# EAGLE schematic Cing bot (EAGLE 7.2.0)
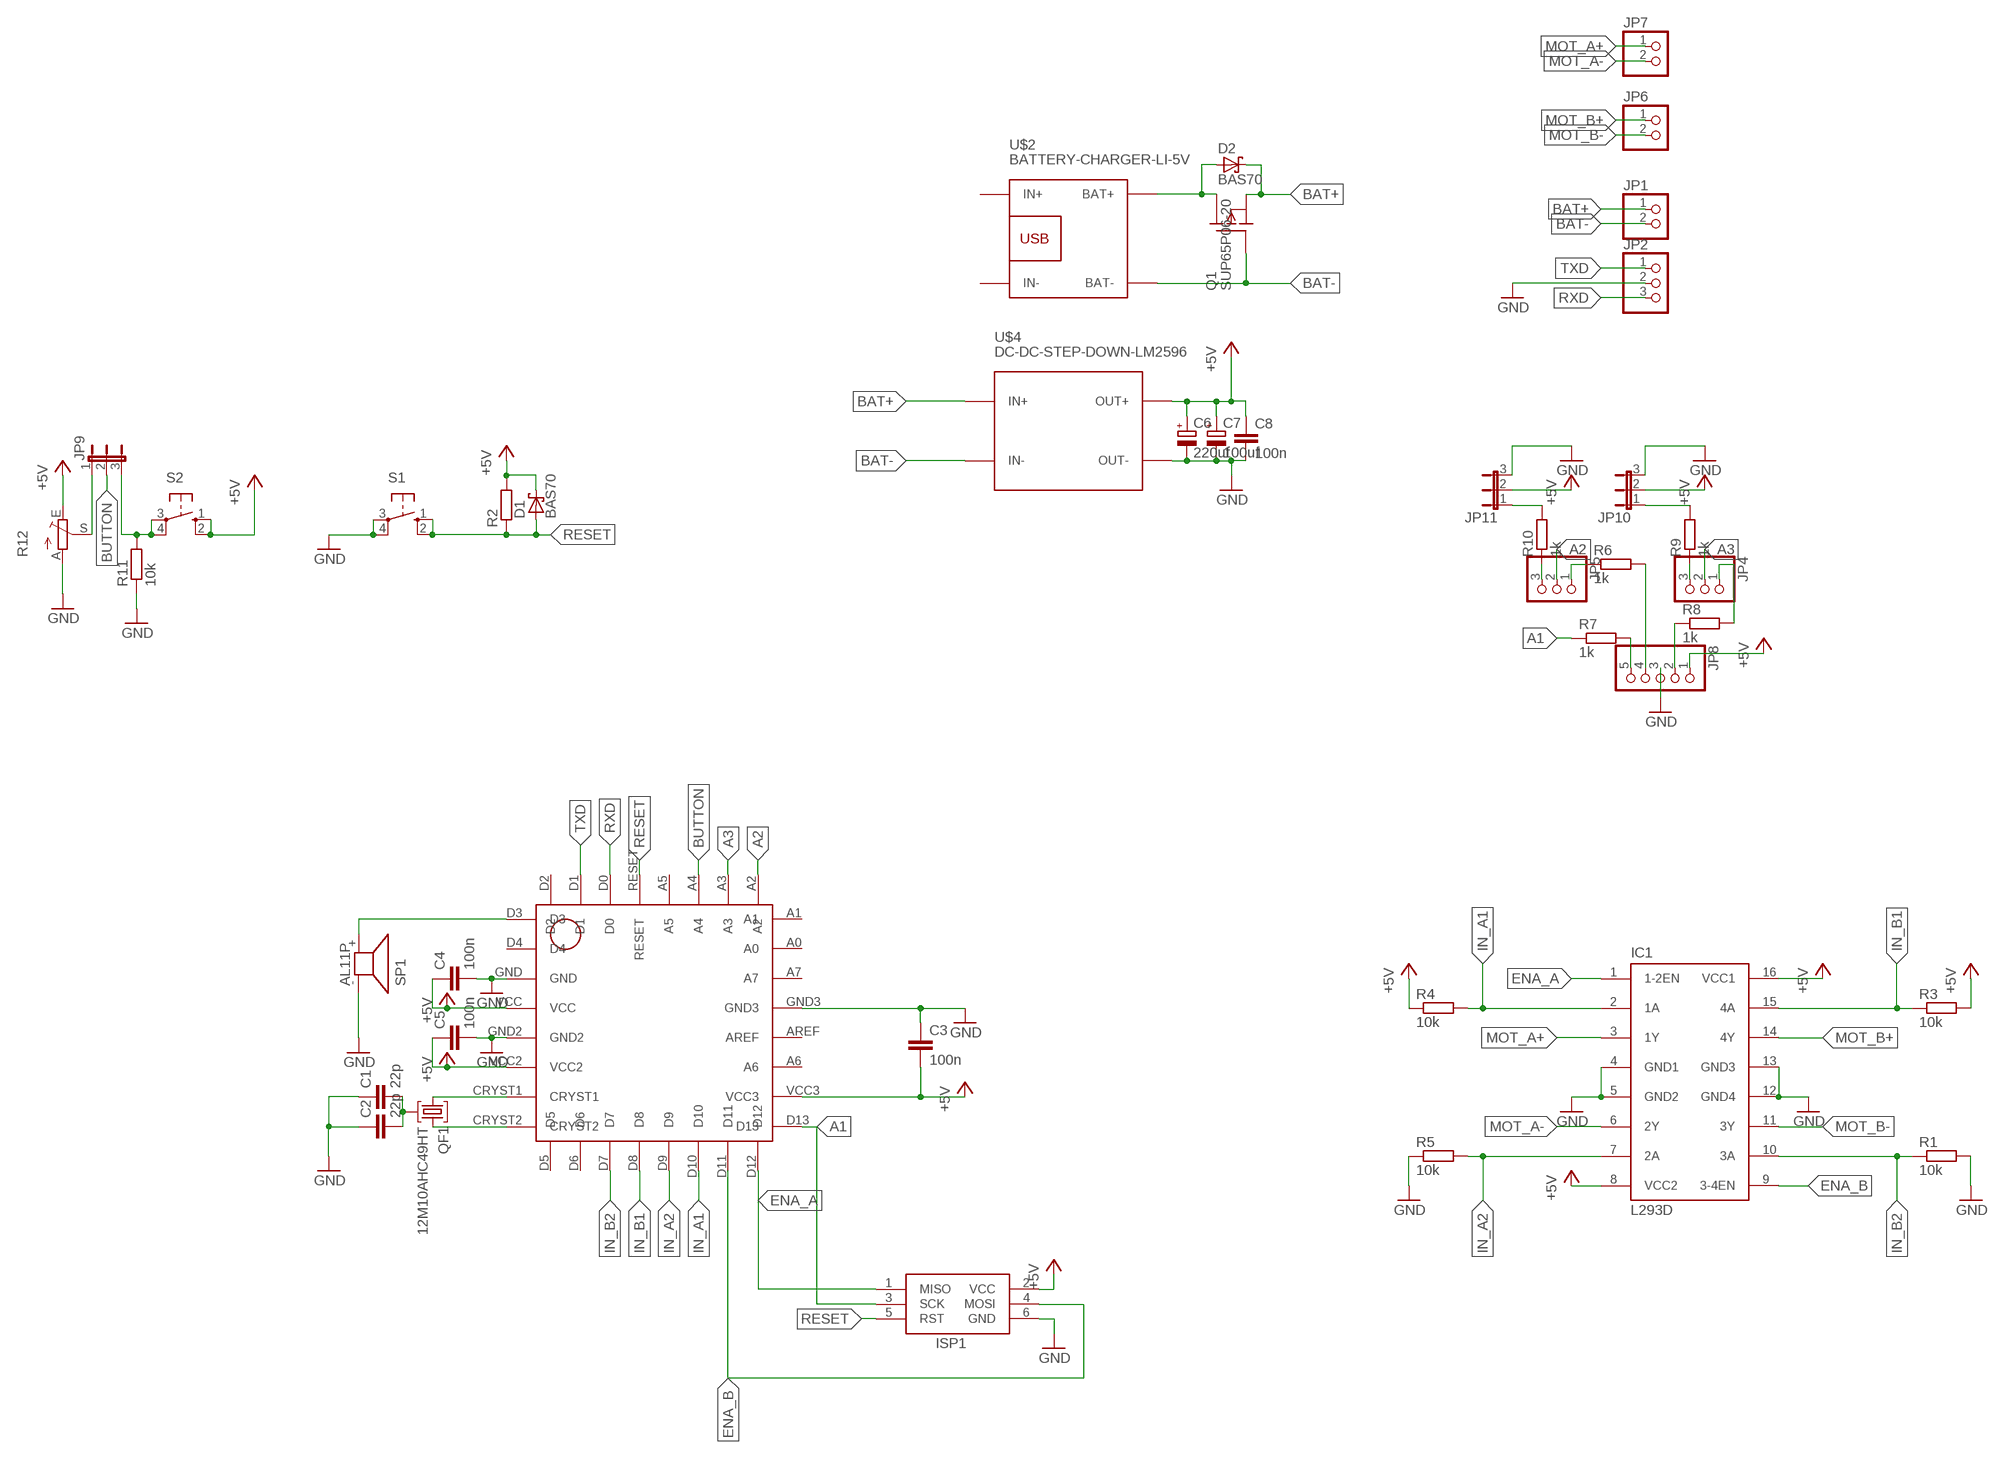
[diagram p0: schematic, sheet 1]

## Parts
C1  22p  C-EUC1206  [C1206]
C2  22p  C-EUC1206  [C1206]
C3  100n  C-EUC1206  [C1206]
C4  100n  C-EUC1206  [C1206]
C5  100n  C-EUC1206  [C1206]
C6  220uf  CPOL-EUE3.5-8  [E3,5-8]
C7  100uf  CPOL-EUE3.5-8  [E3,5-8]
C8  100n  C-EUC1206  [C1206]
D1  BAS70  [SOT23]
D2  BAS70  [SOT23]
IC1  L293D  [DIL16]
ISP1  AVRISP-6  [AVRISP]
JP1  PINHD-1X2  [1X02]
JP2  PINHD-1X3  [1X03]
JP4  PINHD-1X3  [1X03]
JP5  PINHD-1X3  [1X03]
JP6  PINHD-1X2  [1X02]
JP7  PINHD-1X2  [1X02]
JP8  PINHD-1X5  [1X05]
JP9  JP2E  [JP2]
JP10  JP2E  [JP2]
JP11  JP2E  [JP2]
Q1  SUP65P06-20  [TO220]
QF1  12M10AHC49HT  [HC49U]
R1  10k  R-EU_R1206  [R1206]
R2  R-EU_R1206  [R1206]
R3  10k  R-EU_R1206  [R1206]
R4  10k  R-EU_R1206  [R1206]
R5  10k  R-EU_R1206  [R1206]
R6  1k  R-EU_R1206  [R1206]
R7  1k  R-EU_R1206  [R1206]
R8  1k  R-EU_R1206  [R1206]
R9  1k  R-EU_R1206  [R1206]
R10  1k  R-EU_R1206  [R1206]
R11  10k  R-EU_R1206  [R1206]
R12  TRIM_EU-CA6V  [CA6V]
S1  10-XX  [B3F-10XX]
S2  10-XX  [B3F-10XX]
SP1  AL11P  [AL11P]
U$1  PROCESSOR  [PROCESOR]
U$2  BATTERY-CHARGER-LI-5V  [BATTERY-CHARGER-LI-5V]
U$4  DC-DC-STEP-DOWN-LM2596  [DC-DC-STEP-DOWN-LM2596]

## Nets
+5V: C3.2 C4.1 C5.1 C6.+ C7.+ C8.1 D1.3(C) IC1.8(VCC2) IC1.16(VCC1) ISP1.2(VCC) JP8.1 JP10.2 JP11.2 R2.2 R3.2 R4.1 R12.E S2.1(S) S2.2(S1) U$1.VCC U$1.VCC2 U$1.VCC3 U$4.OUT+
A1: ISP1.3(SCK) R7.1 U$1.D13
A2: JP5.2 U$1.A2
A3: JP4.2 U$1.A3
BAT+: D2.3(C) JP1.1 Q1.3(S) U$4.IN+
BAT-: JP1.2 Q1.1(G) U$2.BAT- U$4.IN-
BUTTON: JP9.2 U$1.A4
ENA_A: IC1.1(1-2EN) ISP1.1(MISO) U$1.D12
ENA_B: IC1.9(3-4EN) ISP1.4(MOSI) U$1.D11
GND: C1.1 C2.1 C3.1 C4.2 C5.2 C6.- C7.- C8.2 IC1.4(GND1) IC1.5(GND2) IC1.12(GND4) IC1.13(GND3) ISP1.6(GND) JP2.2 JP8.3 JP10.3 JP11.3 R1.2 R5.1 R11.1 R12.A S1.3(P) S1.4(P1) SP1.- U$1.GND U$1.GND2 U$1.GND3 U$4.OUT-
IN_A1: IC1.2(1A) R4.2 U$1.D10
IN_A2: IC1.7(2A) R5.2 U$1.D9
IN_B1: IC1.15(4A) R3.1 U$1.D8
IN_B2: IC1.10(3A) R1.1 U$1.D7
MOT_A+: IC1.3(1Y) JP7.1
MOT_A-: IC1.6(2Y) JP7.2
MOT_B+: IC1.14(4Y) JP6.1
MOT_B-: IC1.11(3Y) JP6.2
N$1: JP5.1 R6.1
N$2: JP8.2 R8.1
N$3: QF1.3 U$1.CRYST2
N$4: QF1.1 U$1.CRYST1
N$5: C1.2 C2.2 QF1.2
N$6: JP10.1 R9.2
N$7: SP1.+ U$1.D3
N$8: JP11.1 R10.2
N$9: JP4.3 R9.1
N$10: JP8.5 R7.2
N$11: JP8.4 R6.2
N$12: JP4.1 R8.2
N$13: JP5.3 R10.1
N$14: D2.1(A) Q1.2(D) U$2.BAT+
N$16: JP9.3 R11.2 S2.3(P) S2.4(P1)
N$17: JP9.1 R12.S
RESET: D1.1(A) ISP1.5(RST) R2.1 S1.1(S) S1.2(S1) U$1.RESET
RXD: JP2.3 U$1.D0
TXD: JP2.1 U$1.D1
Unconnected: U$1.A0 U$1.A1 U$1.A5 U$1.A6 U$1.A7 U$1.AREF U$1.D2 U$1.D4 U$1.D5 U$1.D6 U$2.IN+ U$2.IN-

## Library data of the parts
C1-C5 C8 = rcl:C-EU: CAPACITOR, European symbol
C6 C7 = rcl:CPOL-EU: POLARIZED CAPACITOR, European symbol
D1 D2 = diode:BAS70: Silicon Schottky Diodes General-purpose diode for high-speed switching
IC1 = st-microelectronics:L293D: PUSH-PULL 4 CHANNEL DRIVER; MPN: L293D; OC_FARNELL: 9589619; OC_NEWARK: 56P8249
ISP1 = adafruit:AVRISP: AVR ISP HEADER Standard 6 pin header for AVR programming
JP1 JP6 JP7 = pinhead:PINHD-1X2: PIN HEADER
JP2 JP4 JP5 = pinhead:PINHD-1X3: PIN HEADER
JP8 = pinhead:PINHD-1X5: PIN HEADER
JP9-JP11 = jumper:JP2E: JUMPER
Q1 = transistor-fet+irf7201:SUP65P06-20: P-Channel Enhancement MOSFET -60V; 60A; 0,020Ohm
QF1 = crystal:12M10AHC49HT: Monolithic Crystal Filters Source: www.vanlong.com; OC_FARNELL: unknown; OC_NEWARK: unknown
R1-R11 = rcl:R-EU_: RESISTOR, European symbol
R12 = pot:TRIM_EU-: POTENTIOMETER
S1 S2 = switch-omron:10-XX: OMRON SWITCH; MPN: B3F-1000; OC_FARNELL: 176432; OC_NEWARK: 36M3542
SP1 = buzzer:AL11P: SPEAKER Source: Buerklin; OC_FARNELL: unknown; OC_NEWARK: unknown
U$1 = PROCESSOR:PROCESSOR
U$2 = diy-modules:BATTERY-CHARGER-LI-5V: Lithium Battery 5V Charger More details available here: http://www.buildcircuit.com/how-to-use-micro-usb-5v-1a-lithium-battery-charging-board-charger-module/ Click here to find device on ebay.com <http://www.ebay.com/sch/tp4056+charger+usb>
U$4 = diy-modules:DC-DC-STEP-DOWN-LM2596: DC/DC Step-Down Regulator based on LM2596-ADJ chip LM2596 datasheet available here: http://www.ti.com/lit/ds/symlink/lm2596.pdf Click here to find device on ebay.com <http://www.ebay.com/sch/lm2596+power+regulator>